# Altium schematic sheet CAN.SchDoc
size B
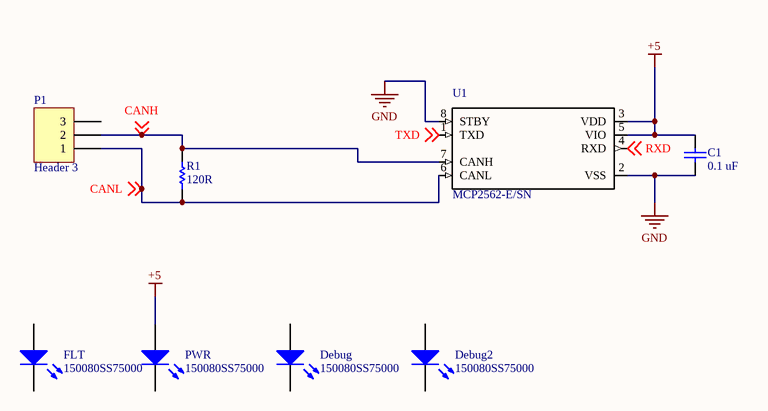
[diagram p0: CAN.SchDoc]

## Parts
C1  0.1 uF  [CAPC2013X140X50LL20T25]
Debug  150080SS75000  [0805_A]
Debug2  150080SS75000  [0805_A]
FLT  150080SS75000  [0805_A]
P1  Header 3  [HDR1X3]
PWR  150080SS75000  [0805_A]
R1  120R  [RESC0805(2012)_N]
U1  MCP2562-E/SN  [SOIC127P600X175-8N]

## Nets
+5: C1.1 PWR.2(A) U1.3(VDD) U1.5(VIO)
GND: C1.2 U1.2(VSS) U1.8(STBY)
CANH: P1.2 R1.2 U1.7(CANH) ; off-sheet CANH
CANL: P1.1 R1.1 U1.6(CANL) ; off-sheet CANL
RXD: U1.4(RXD) ; off-sheet RXD
TXD: U1.1(TXD) ; off-sheet TXD

Not connected (* = marked no-connect by the designer): Debug 1(K) 2(A); Debug2 1(K) 2(A); FLT 1(K) 2(A); P1 3; PWR 1(K)

## Library data of the parts
C1 = CMP-2000-05810-1: Chip Capacitor, 2.2 uF, +/- 10%, 10 V, -55 to 85 degC, 0805 (2012 Metric), RoHS, Tape and Reel; Manufacturer: AVX; Dielectric: X5R; Rated Voltage: 10V; Capacitance: 2.2µF; Tolerance (%): ±10%; Datasheet Version: 05/2016; Manufacturer URL: http://www.avx.com/; Package Description: 2-Pin Surface Mount Device, Body 2.01 x 1.25 mm; Mounting Technology: SurfaceMount; Case Size/Dimension: 0805; Package Reference: 0805; Datasheet URL: http://datasheets.avx.com/cx5r.pdf
Debug Debug2 FLT PWR = CMP-1426-00010-1: SMD mono-color Chip LED, WL-SMCW, Super Red; Manufacturer: Wuerth Elektronik; PackageReference: 0805_A; ComponentLink2URL: http://katalog.we-online.com/led/datasheet/150080SS75000.pdf; ComponentLink1URL: http://www.we-online.com; Color: Super Red; ComponentLink2Description: Datasheet; ComponentLink1Description: Manufacturer URL; PartNumber: 150080SS75000
P1 = Header 3: Header, 3-Pin; LatestRevisionDate: 17-Jul-2002; LatestRevisionNote: Re-released for DXP Platform.; Publisher: Altium Limited
R1 = Resistor 0805: Generic 0805 Resistor; Tolerance: 5 %; Case-Metric: 2012; Value: 120.00 Ohm; Case-EIA: 0805; Power: 0.125 W; Technology: SMT
U1 = CAN Tranceiver: Microchip MCP2562-E/SN, CAN Transceiver 1MBps 1-channel IEC 61000-4-2, 8-Pin SOIC; Price: None; MF: Microchip; SnapEDA_Link: https://www.snapeda.com/parts/MCP2562-E/SN/Microchip/view-part/?ref=snap; MP: MCP2562-E/SN; Availability: Unavailable; Package: SO-8 Microchip; Value: *